# EAGLE design Thermo (EAGLE 9.6.2)
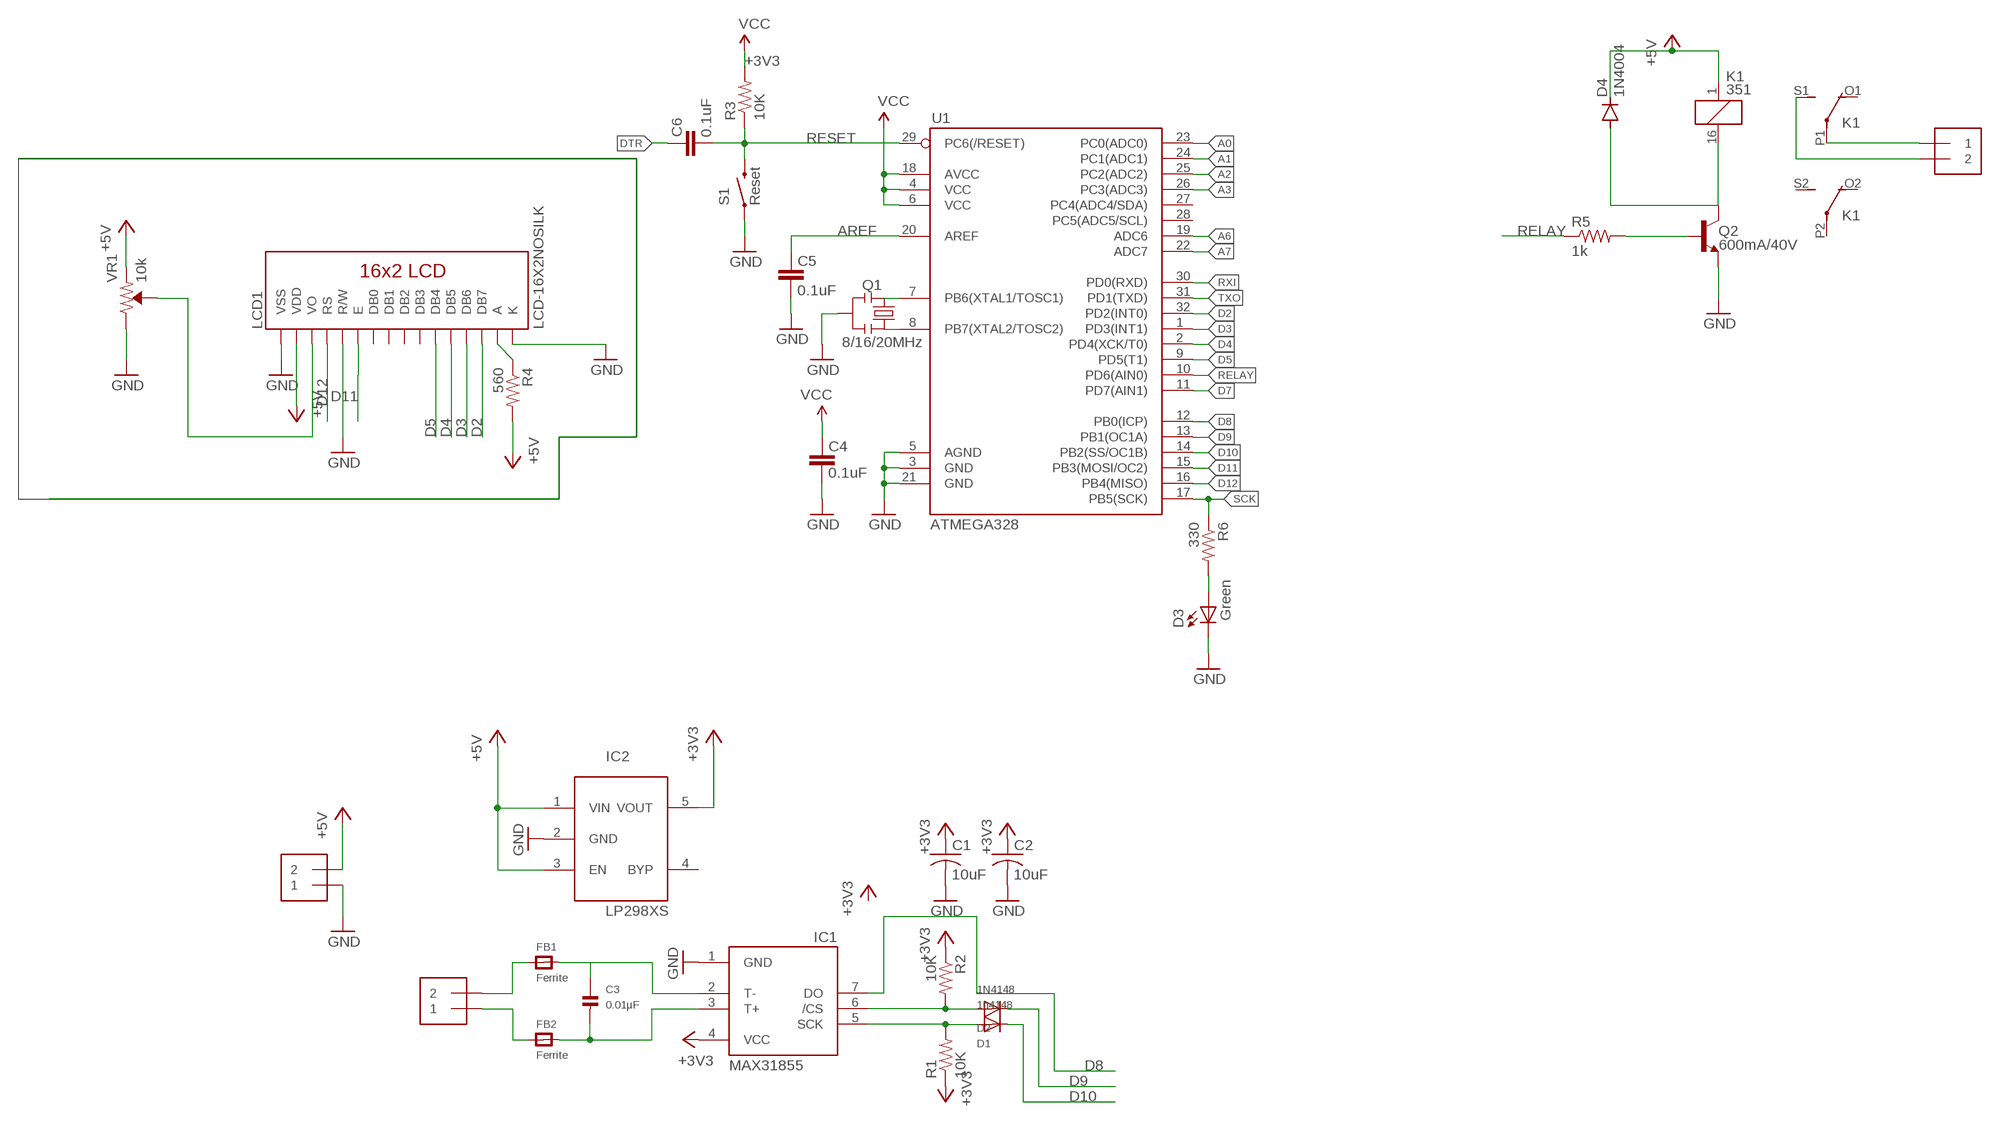
[diagram p0: schematic, sheet 1]

## Parts
C1  10uF  C-USC0805K  [C0805K]
C2  10uF  C-USC0805K  [C0805K]
C3  0.01µF  CAP_CERAMIC_0805  [_0805]
C4  0.1uF  CAP0603-CAP  [0603-CAP]
C5  0.1uF  CAP0603-CAP  [0603-CAP]
C6  0.1uF  CAP0603-CAP  [0603-CAP]
D1  1n4148  DIODESOD-323F  [SOD-323F]
D2  1N4148  DIODESOD-323F  [SOD-323F]
D3  Green  LED  [0603-LED-ALT1]
D4  1N4004  [DO41-10]
FB1  Ferrite  FERRITE_0805  [_0805]
FB2  Ferrite  FERRITE_0805  [_0805]
IC1  MAX31855  MAX6675  [SO08]
IC2  LP298XS  [SOT23-5L]
J1  1X2-3.5MM  [1X2-3.5MM]
J2  1X2-3.5MM  [1X2-3.5MM]
J3  1X2-3.5MM  [1X2-3.5MM]
K1  351  [351]
LCD1  LCD-16X2NOSILK  [LCD-16X2_NOSILK]
Q1  8/16/20MHz  RESONATOR1:1  [RESONATOR-SMD-1:1]
Q2  600mA/40V  TRANS_NPN-MMBT2222AL  [SOT23-3]
R1  10K  R-US_R0805  [R0805]
R2  10K  R-US_R0805  [R0805]
R3  10K  RESISTOR0805-RES  [0805]
R4  560  RESISTOR0805-RES  [0805]
R5  1k  RESISTOR0805-RES  [0805]
R6  330  RESISTOR0805-RES  [0805]
S1  Reset  SWITCH-MOMENTARY-2SMD-ALT01  [TACTILE-SWITCH-SMD-ALT01]
U1  ATMEGA328  ATMEGA168  [TQFP32-08]
VR1  10k  TRIMPOT-SMD-3MM-CLOSED-1/8W-20%  [TRIMPOT-SMD-3MM-CLOSED]

## Nets
+3V3: C1.1 C2.1 IC1.4(VCC) IC2.5(VOUT) R1.1 R2.1 R3.2 ; supply symbol labelled VCC
+5V: D4.C IC2.1(VIN) IC2.3(EN) J2.2 K1.1 LCD1.2(VDD) R4.2 VR1.1(CCW)
A0: U1.23(PC0(ADC0))
A1: U1.24(PC1(ADC1))
A2: U1.25(PC2(ADC2))
A3: U1.26(PC3(ADC3))
A6: U1.19(ADC6)
A7: U1.22(ADC7)
AREF: C5.2 U1.20(AREF)
CS: D2.A IC1.6(/CS) R2.2
D2: LCD1.14(DB7) U1.32(PD2(INT0))
D3: LCD1.13(DB6) U1.1(PD3(INT1))
D4: LCD1.12(DB5) U1.2(PD4(XCK/T0))
D5: LCD1.11(DB4) U1.9(PD5(T1))
D7: U1.11(PD7(AIN1))
D8: IC1.7(DO) U1.12(PB0(ICP))
D9: D2.C U1.13(PB1(OC1A))
D10: D1.C U1.14(PB2(SS/OC1B))
D11: LCD1.6(E) U1.15(PB3(MOSI/OC2))
D12: LCD1.4(RS) U1.16(PB4(MISO))
DTR: C6.2
GND: C1.2 C2.2 C4.1 C5.1 D3.C IC1.1(GND) IC2.2(GND) J2.1 LCD1.1(VSS) LCD1.5(R/W) LCD1.16(K) Q1.2 Q2.2(E) S1.1 S1.2 U1.3(GND) U1.5(AGND) U1.21(GND) VR1.3(CW)
N$1: FB1.1 J1.2
N$2: LCD1.15(A) R4.1
N$3: LCD1.3(VO) VR1.2(WIPER)
N$4: C3.1 FB1.2 IC1.2(T-)
N$5: FB2.1 J1.1
N$6: C3.2 FB2.2 IC1.3(T+)
N$7: D3.A R6.2
N$8: Q1.3 U1.8(PB7(XTAL2/TOSC2))
N$9: Q1.1 U1.7(PB6(XTAL1/TOSC1))
N$10: Q2.1(B) R5.2
N$11: D4.A K1.16 Q2.3(C)
N$12: J3.1 K1.P1(2:P)
N$13: J3.2 K1.S1(2:S)
RELAY: R5.1 U1.10(PD6(AIN0))
RESET: C6.1 R3.1 S1.3 S1.4 U1.29(PC6(/RESET))
RXI: U1.30(PD0(RXD))
SCK: D1.A IC1.5(SCK) R1.2 R6.1 U1.17(PB5(SCK))
TXO: U1.31(PD1(TXD))
VCC: C4.2 U1.4(VCC) U1.6(VCC) U1.18(AVCC)
Unconnected: IC2.4(BYP) K1.O1(2:O) K1.O2(3:O) K1.P2(3:P) K1.S2(3:S) LCD1.7(DB0) LCD1.8(DB1) LCD1.9(DB2) LCD1.10(DB3) U1.27(PC4(ADC4/SDA)) U1.28(PC5(ADC5/SCL))

## Library data of the parts
C1 C2 = adafruit:C-US: CAPACITOR, American symbol
C3 = microbuilder:CAP_CERAMIC: Ceramic Capacitors 0402 - 0402 Surface Mount Capacitors 16pF 50V 5% [Digikey: 445-4899-2-ND] 18pF 50V 5% [Digikey: 490-1281-2-ND] 22pF 50V 5% [Digikey: 490-1283-2-ND] 68pF 50V 5% [Digikey: 490-1289-2-ND] 0.1uF 10V 10% [Digikey: 490-1318-2-ND] 1.0uF 6.3V 10% [Digikey: 490-1320-2-ND] 0603 - 0603 Surface Mount Capacitors 16 pF 50V 5% [Digikey: 445-5051-2-ND] 22 pF 50V [Digikey: PCC220ACVTR-ND] 33 pF 50V 5% [Digikey: 490-1415-1-ND] 56pF 50V 5% [Digikey: 490-1421-1-ND] 220pF 50V 5% [Digikey: 445-1285-1-ND] 680 pF 50V 2200 pF 50V 5% C0G [Digikey: 445-1297-1-ND] 5600 pF 100V 5% X7R [Digikey: 478-3711-1-ND] 0.1 µF 25V 10% [Digikey: PCC2277TR-ND] 0.22 µF 16V 10% X7R [Digikey: 445-1318-1-ND] 1.0 µF 25V 10% [Digikey: 445-5146-2-ND] 0603 - RF Specific 3pF 250V +/-0.1pF RF [Digikey: 712-1347-1-ND] 18 pF 250V 5% [Digikey: 478-3505-1-ND or 712-1322-1-ND] 56 pF 250V 5% C0G RF [Digikey: 490-4867-1-ND] 68 pF 250V RF [Digikey: 490-4868-1-ND] 0805 - 0805 Surface Mount Capacitors 220 pF 250V 2% RF Ceramic Capacitor [Digikey: 712-1398-1-ND] 1000 pF 50V 2% NP0 Ceramic Capacitor [Digikey: 478-3760-1-ND] 0.1 µF 25V 10% Ceramic Capacitor [Digikey: PCC1828TR-ND] 1.0 µF 16V 10% Ceramic Capacitor[Digikey: 490-1691-2-ND] 10.0 µF 10V 10% Ceramic Capacitor[Digikey: 709-1228-1-ND] 10.0 uF 16V 10% Ceramic Capacitor [Digikey: 478-5165-2-ND] 47 uF 6.3V 20% Ceramic Capacitor [Digikey: 587-1779-1-ND or 399-5506-1-ND] 1206 - 1206 Surface Mount Capacitors 47uF 10V 20% Ceramic Capacitor [Digikey: 490-5528-1-ND or 399-5508-1-ND or 445-6010-1-ND] 100uF 6.3V -20%, +80% Y5V Ceramic Capacitor (Digikey: 490-4512-1-ND, Mouser: 81-GRM31CF50J107ZE1L)
C4-C6 = SparkFun:CAP: Capacitor Standard 0603 ceramic capacitor, and 0.1" leaded capacitor.
D1 D2 = adafruit:DIODE: Diode SMADIODE - SMA Surface Mount Package 20V 1A Schottky Diode Digikey: 641-1014-6-ND DO-1N4148 - Through Hole Small Current Diode SOD-123 20V 1 A (.5mV Vf) Schottky Diode - Digikey: MBRX120TPMSCT-ND SOD-323 10V 570mA (.38mV Vf, 3ns) Schottky Diode - Digikey: ZLLS410CT-ND SOD-523 30V 30mA Schottky Diode (RB751S-40TE61) - Digikey: RB751S-40TE61CT-ND SOT23-R/W - SOT23 Package (R = Solder Paste/Reflow Ovens, W = Hand-Soldering) BAT54Film 40V 300mA - Digikey: 497-7162-1-ND
D3 = Testing:LED: LEDs Standard schematic elements and footprints for 5mm, 3mm, 1206, and 0603 sized LEDs. 5mm - Spark Fun Electronics SKU : COM-00529 (and others)
D4 = diode:1N4004: DIODE general purpose rectifier, 1 A
FB1 FB2 = microbuilder:FERRITE: Ferrite Bead 0603 MMZ1608B121C - 120 Ohm @ 100MHz, 600mA, 0.15 Ohm DC Resistance - Digikey: 445-2164-1-ND BK1608HW121-T - 120 Ohm, 600mA Ferrite Chip - Digikey: 587-1876-2-ND 0805 HZ0805B272R-10 - 2.7K Ohm @ 100MHz, 200mA, 0.8 Ohm DC Resistance - Digikey: 240-2504-1-ND (see also Murata BLM21BD272SN1L) MMZ2012Y152B - 1.5K Ohm @ 100MHz, 500mA, 0.4 Ohm DC Resistance - Digikey: 445-1560-1-ND - Mainly for high frequency (80-400MHz) MMZ2012R102A - 1K Ohm @ 100MHz, 500mA, 0.3 Ohm DC Resistance - Digikey: 445-1555-2-ND - More general purpose (10-200MHz)
IC1 = adafruit:MAX6675
IC2 = adafruit:LP298X
J1-J3 = adafruit:1X2: 3.5mm Terminal block http://www.ladyada.net/library/pcb/eaglelibrary.html
K1 = relay:351: RELAY 2 x switch, Omron; OC_FARNELL: unknown; OC_NEWARK: unknown
LCD1 = SparkFun-Displays:LCD-16X2: Standard text-only 16x2 parallel input LCD Basic 16 character by 2 line display. Typically utilizes the extremely common HD44780 parallel interface chipset SparkFun Products: Basic 16x2 Green <https://www.sparkfun.com/products/255> Basic 8x2 Green <https://www.sparkfun.com/products/11122>; SF_ID: LCD-00255
Q1 = Testing:RESONATOR: Resonator Small SMD resonator. This is the itty bitty 10/20MHz resonators with built in caps. CSTCE10M0G55 and CSTCE20M0V53. Footprint for SMD has been used in SFE production for years, and does work okay. 1:1 is an attempt to get larger fillets on the sides so it will be easier to inspect these solders in our AOI machine. The pads have been minimized to match the actual metal under the resonator. To see this relation, it includes an image import of the bottom side of the component. Imported to scale on layer 200.
Q2 = SparkFun-DiscreteSemi:TRANS_NPN: NPN transistor Current controlled devices typically used to amplify current or used as a switch. BC547 - COM-08928 <http://www.sparkfun.com/products/8928> (TO-92 45V 100mA) (1.Collector 2.Base 3.Emitter) 2N3904 - COM-00521 <http://www.sparkfun.com/products/521> (TO-92 40V 200mA) (1.Emitter 2.Base 3.Collector) P2N2222A - COM-12852 <http://www.sparkfun.com/products/12852> (TO-92 40V 600mA) (1.Collector 2.Base 3.Emitter); PROD_ID: TRANS-08049
R1 R2 = adafruit:R-US_: RESISTOR, American symbol
R3-R6 = SparkFun:RESISTOR: Resistor Basic schematic elements and footprints for 0603, 1206, and PTH resistors.
S1 = Testing:SWITCH-MOMENTARY-2: Various NO switches- pushbuttons, reed, etc
U1 = SparkFun:ATMEGA168
VR1 = SparkFun-Resistors:TRIMPOT: Trimming Potentiometer (Trimpot) Three-terminal potentiometers, with an adjustable wiper and two adjustable resistors. A pot can be used to create a configurable voltage divider, or as a variable resistor. "Trimpots" are a subset of potentiometers, usually intended for "set-and-forget" applications. They're often more delicate than standard potentiometers - rated for fewer turns. Variants PTH-KNOB - PTH Trimpot w/ finger-adjustable knob Trimpot 10K with Knob <https://www.sparkfun.com/products/9806> (COM-09806) Datasheet <http://www.sparkfun.com/datasheets/Components/General/TSR-3386.pdf> SMD-3MM-CLOSED-FRAME - SMD 3mm Square Closed-Frame Trimpot Used on e.g. EasyDriver - Stepper Motor Driver <https://www.sparkfun.com/products/12779> Datasheet <http://www.bitechnologies.com/pdfs/22.pdf> (22AR10KTR) SMD-5MM - SMD 5mm Square Closed-Frame Trimpot Used on e.g. IOIO-OTG - V2.2 <https://www.sparkfun.com/products/13613> Datasheet <http://www.vishay.com/docs/51008/ts53.pdf> (TS53YL502MR10) SMD-3MM-1/10W-25% - 3mm Square Open-Frame Trimpot Used on e.g. SparkFun Shapeoko <https://www.sparkfun.com/products/13899> Datasheet <http://www.bourns.com/docs/Product-Datasheets/TC33.pdf> (TC33X-2-103E); PROD_ID: RES-09285

## Net classes
1 vcc: width 0.254 mm

## Board
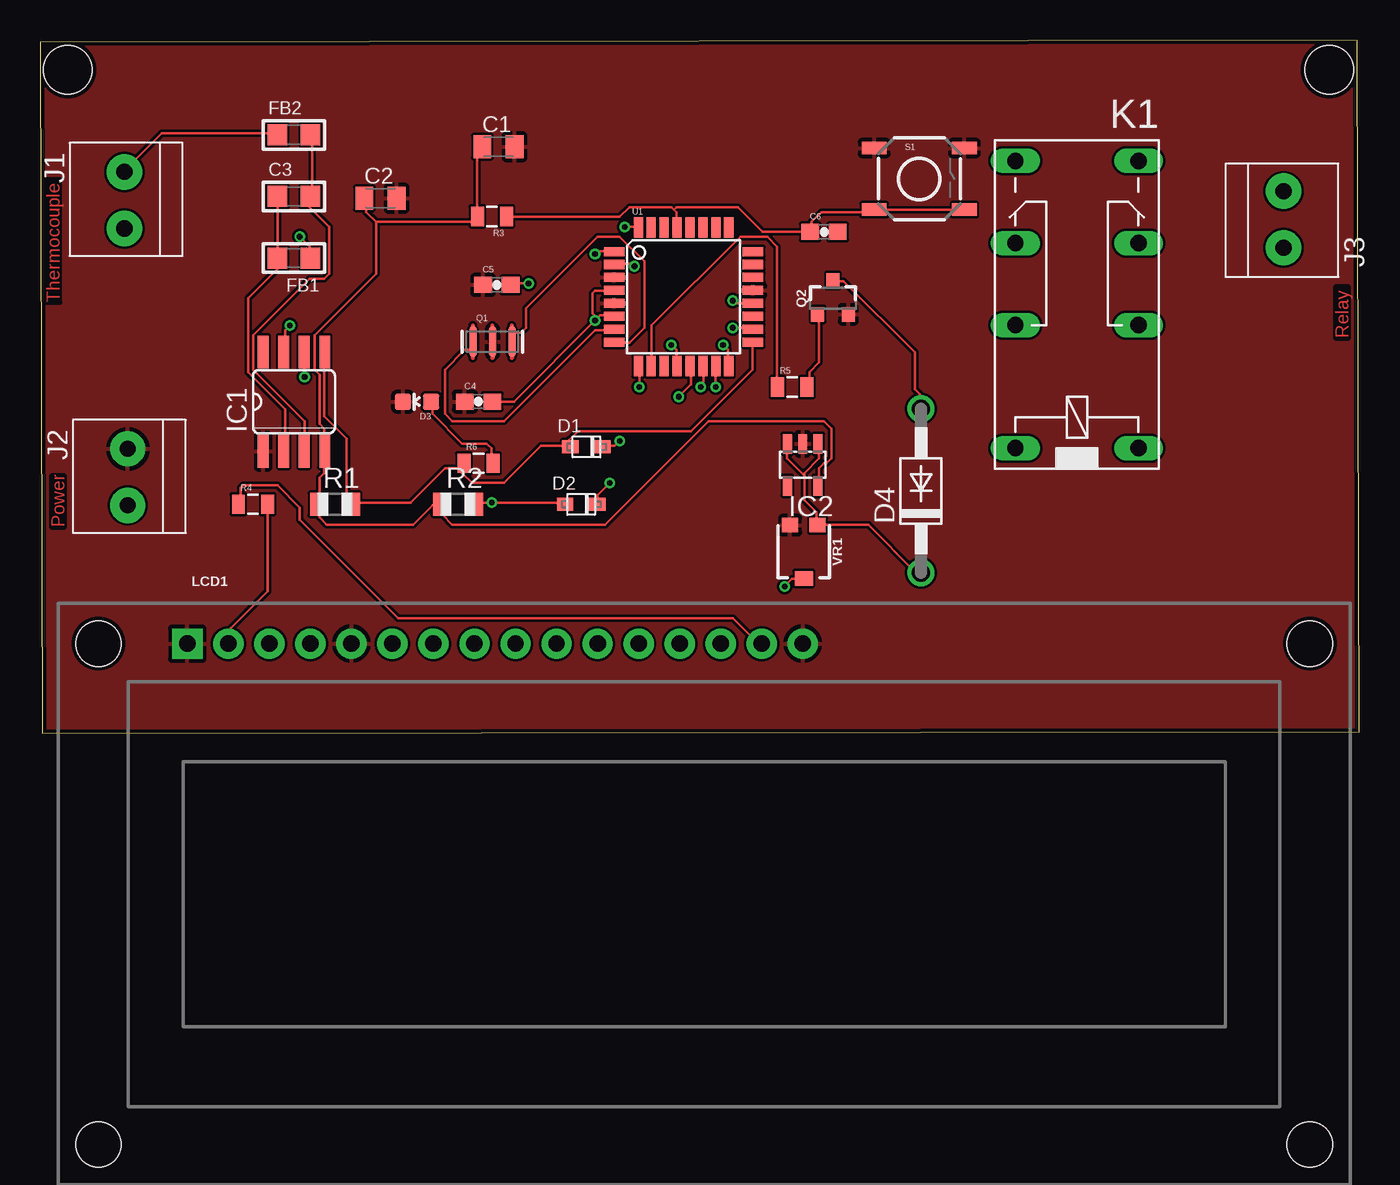
[diagram p1: board, top side]
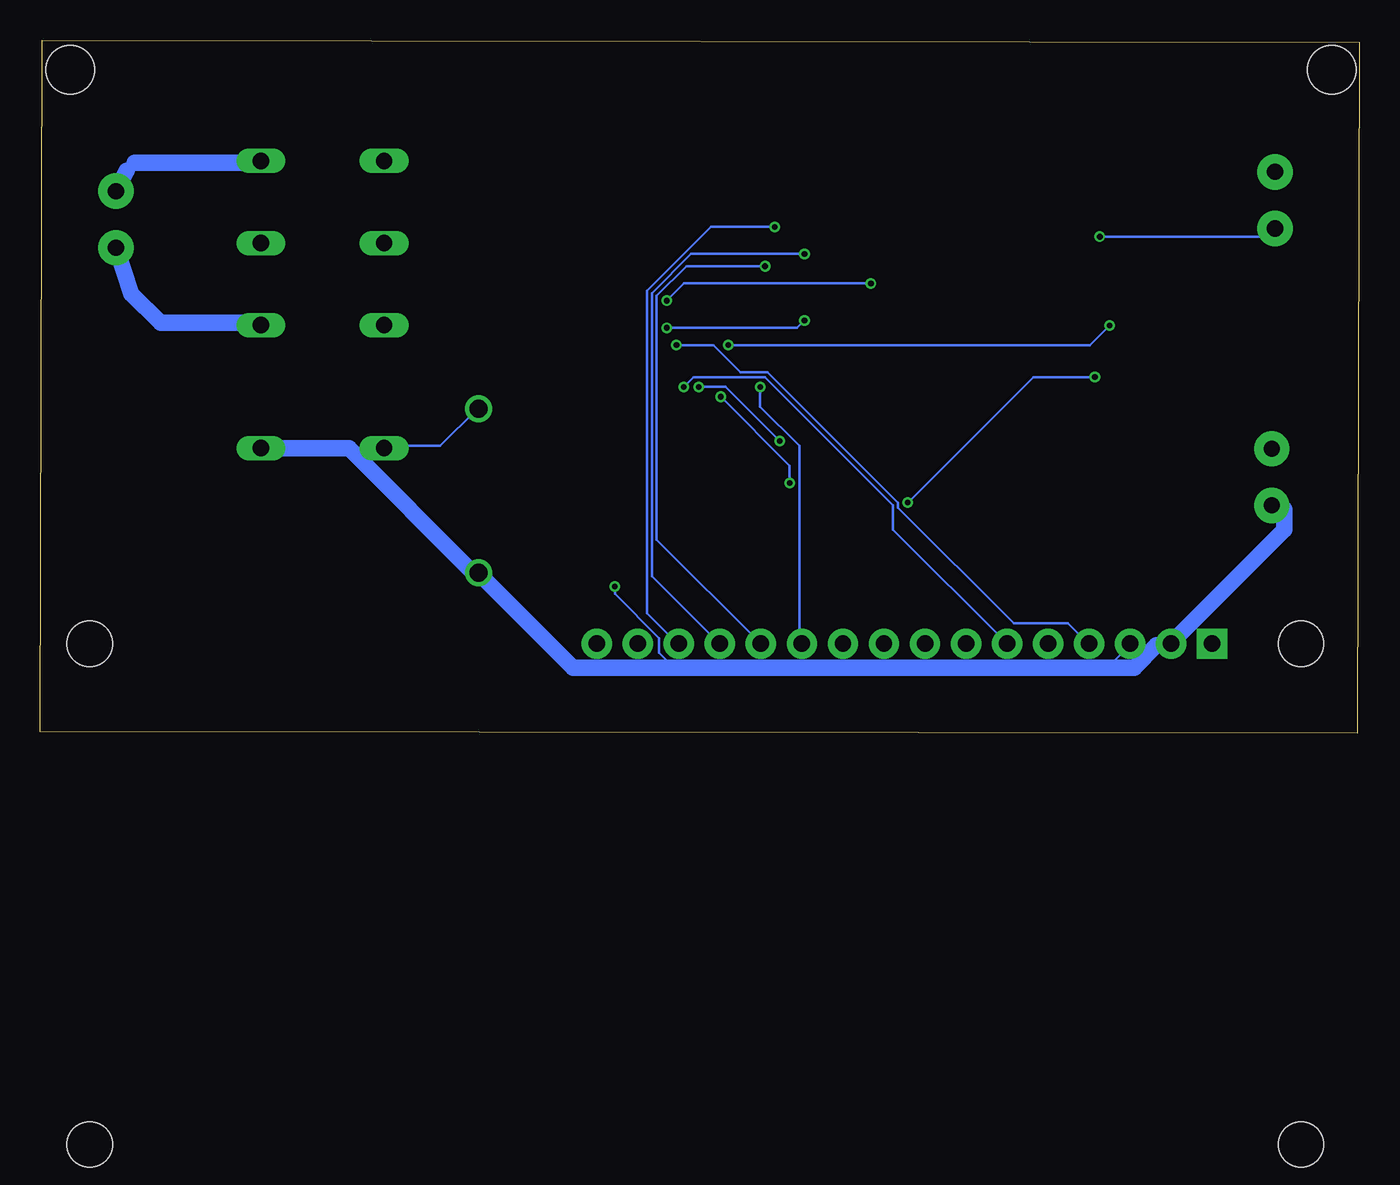
[diagram p2: board, bottom side, seen from below]

Size 81.65 x 42.88 mm. Coordinates in mm from the lower left corner, seen from the top.
Outline: 0.1,0 81.65,0.1 81.55,42.88 0,42.78 0.1,0
Copper layers (1*16): Top 0.035mm / dielectric 1.5mm / Bottom 0.035mm
Design rules "SeeedStudio_2layer_DRU_no_angle_20140221": minimum track width 6mil, minimum drill 12mil, track to track 6mil, track to pad 6mil, pad to pad 6mil, via to via 6mil, smd to smd 0mil, copper to edge 10mil, drill to drill 10mil, minimum pad ring 10mil, minimum via ring 6mil, stop-mask expansion 2mil, vias tented up to drill 100mil, thermal gap 10mil
Holes 3 mm at 1.7,41.06 79.8,41.06

### Footprints (pad centres in the part's own frame; a part is rotated, then mirrored left to right if it is on the bottom)
C0805K = smd 1.1 x 1.4: 1 -1,0; 2 1,0
_0805 = smd 1.2 x 1.3: 1 -1.016,0; 2 1.016,0
0603-CAP = smd 1.1 x 1: 1 -0.85,0; 2 0.85,0
SOD-323F = smd 1 x 0.8: A -1,0; C 1,0
0603-LED-ALT1 = smd 1 x 1: A 0,-0.877; C 0,0.877
DO41-10 = drill 1.118: A 5.08,0; C -5.08,0
SO08 = smd 0.66 x 2.032: 1 -1.905,-3.073; 2 -0.635,-3.073; 3 0.635,-3.073; 4 1.905,-3.073; 5 1.905,3.073; 6 0.635,3.073; 7 -0.635,3.073; 8 -1.905,3.073
SOT23-5L = smd 0.55 x 1.2: 1 -0.95,-1.3; 2 0,-1.3; 3 0.95,-1.3; 4 0.95,1.3; 5 -0.95,1.3
1X2-3.5MM = drill 1 pad 2.184: 1 1.8,0; 2 -1.7,0
351 = drill 1.016 long: 1 -3.81,-3.81; 16 -3.81,3.81; O1 8.89,-3.81; O2 8.89,3.81; P1 3.81,-3.81; P2 3.81,3.81; S1 13.97,-3.81; S2 13.97,3.81
LCD-16X2_NOSILK = drill 1.016 pad 1.88 square: 1 -32,15.5 | drill 1.016 pad 1.88: 2 -29.46,15.5; 3 -26.92,15.5; 4 -24.38,15.5; 5 -21.84,15.5; 6 -19.3,15.5; 7 -16.76,15.5; 8 -14.22,15.5; 9 -11.68,15.5; 10 -9.14,15.5; 11 -6.6,15.5; 12 -4.06,15.5; 13 -1.52,15.5; 14 1.02,15.5; 15 3.56,15.5; 16 6.1,15.5 | hole 2.8: -37.5,15.5; -37.5,-15.5; 37.5,15.5; 37.5,-15.5
RESONATOR-SMD-1:1 = smd 0.45 x 1.905: 1 -1.2,0; 2 0,0; 3 1.2,0
SOT23-3 = smd 0.8 x 0.9: 1 -0.95,-1; 2 0.95,-1; 3 0,1.1
R0805 = smd 1.1 x 1.4: 1 -1,0; 2 1,0
0805 = smd 0.8 x 1.2: 1 -0.9,0; 2 0.9,0
TACTILE-SWITCH-SMD-ALT01 = smd 1.524 x 0.762: 1 -2.794,1.905; 2 2.794,1.905; 3 -2.794,-1.905; 4 2.794,-1.905
TQFP32-08 = smd 1.27 x 0.559: 1 -4.293,2.8; 2 -4.293,2; 3 -4.293,1.2; 4 -4.293,0.4; 5 -4.293,-0.4; 6 -4.293,-1.2; 7 -4.293,-2; 8 -4.293,-2.8; 17 4.293,-2.8; 18 4.293,-2; 19 4.293,-1.2; 20 4.293,-0.4; 21 4.293,0.4; 22 4.293,1.2; 23 4.293,2; 24 4.293,2.8 | smd 0.559 x 1.27: 9 -2.8,-4.293; 10 -2,-4.293; 11 -1.2,-4.293; 12 -0.4,-4.293; 13 0.4,-4.293; 14 1.2,-4.293; 15 2,-4.293; 16 2.8,-4.293; 25 2.8,4.293; 26 2,4.293; 27 1.2,4.293; 28 0.4,4.293; 29 -0.4,4.293; 30 -1.2,4.293; 31 -2,4.293; 32 -2.8,4.293
TRIMPOT-SMD-3MM-CLOSED = smd 1 x 0.9: 1 -0.85,-1.65; 3 0.85,-1.65 | smd 1.1 x 0.9: 2 0,1.65

### Placement (x,y rotation side)
C1  28.36,36.3 0 top
C2  21.06,33.11 0 top
C3  15.7,33.22 0 top
C4  27.13,20.52 0 top
C5  28.26,27.75 0 top
C6  48.52,31.03 0 top
D1  33.81,17.72 0 top
D2  33.48,14.17 0 top
D3  23.32,20.52 90 top
D4  54.53,15 90 top
FB1  15.7,29.41 180 top
FB2  15.7,37.03 0 top
IC1  15.7,20.52 0 top
IC2  47.2,16.61 180 top
J1  5.21,32.94 90 top
J2  5.41,15.8 90 top
J3  76.97,31.85 270 top
K1  64.18,21.45 90 top
LCD1  41.1,-9.96 0 top
Q1  27.99,24.23 0 top
Q2  49.07,26.92 0 top
R1  18.24,14.17 0 top
R2  25.86,14.17 0 top
R3  27.96,31.99 180 top
R4  13.16,14.17 0 top
R5  46.55,21.42 0 top
R6  27.13,16.71 0 top
S1  54.42,34.31 0 top
U1  39.82,27.01 0 top
VR1  47.27,11.23 180 top

### Tracks (layer width: path | path; a pad name or v marks a point on that pad's centre or on a via)
+3V3
  Top 0.152: C1.1 27.33,36.22 27.03,35.91 27.03,32.1 R3.2 27.03,31.95 26.72,31.64 20.78,31.64 | 20.78,31.64 20.17,32.25 20.17,33.02 C2.1 | IC2.5 48.21,15.34 48.21,16.41 48.52,16.71 48.67,16.71 48.97,17.02 48.97,18.84 48.52,19.3 41.35,19.3 34.95,12.9 25.5,12.9 24.89,13.51 24.89,14.12 R2.1 24.74,14.12 24.29,14.12 23.07,12.9 17.73,12.9 17.28,13.36 17.28,14.12 R1.1 17.28,14.27 17.28,15.8 17.58,16.1 17.58,17.32 IC1.4 17.58,17.47 17.58,18.84 17.28,19.15 17.28,22.2 16.97,22.5 16.97,24.64 20.78,28.45 20.78,31.64
+5V
  Top 0.152: R4.2 14.07,14.12 14.07,8.79 11.79,6.5 11.79,5.58 LCD1.2 | 47.3,15.95 47.3,16.1 48.21,17.02 48.21,17.78 IC2.1 | 47.3,15.95 47.3,14.42 48.06,13.66 48.06,12.9 VR1.1 48.21,12.9 51.26,12.9 54.16,10 54.46,10 D4.C | 47.3,15.95 46.23,17.02 46.23,17.78 IC2.3
  Bottom 0.152: 4.63,13.88 J2.2 | 11.64,5.58 LCD1.2 11.79,5.43 12.55,5.43 | 54.92,10 54.61,10 D4.C 54.46,9.85 | 67.87,17.62 K1.1
  Bottom 1.016: 4.63,13.88 4.63,12.6 11.64,5.58 | 67.87,17.62 62.54,17.62 54.92,10 | 12.55,5.43 13.92,4.06 48.67,4.06 54.46,9.85
AREF  (via drill 0.35)
  Top 0.152: v30.23,27.84 29.16,27.84 C5.2 | v42.88,26.77 43.03,26.62 44.1,26.62 U1.20
  Bottom 0.152: v30.23,27.84 41.81,27.84 v42.88,26.77
CS  (via drill 0.35)
  Top 0.152: D2.A 32.36,14.27 v27.94,14.27 26.88,14.27 R2.2 | v16.36,22.04 16.36,23.57 IC1.6
  Bottom 0.152: v16.36,22.04 20.17,22.04 v27.94,14.27
D2  (via drill 0.35)
  Top 0.152: v36.17,31.34 36.93,31.34 U1.32
  Bottom 0.152: v36.17,31.34 40.14,31.34 44.1,27.38 44.1,7.41 42.27,5.58 LCD1.14
D3  (via drill 0.35)
  Top 0.152: v34.34,29.66 34.5,29.82 35.41,29.82 U1.1
  Bottom 0.152: v34.34,29.66 41.35,29.66 43.79,27.23 43.79,9.7 39.68,5.58 LCD1.13
D4  (via drill 0.35)
  Top 0.152: v36.78,28.9 36.63,29.05 35.56,29.05 U1.2
  Bottom 0.152: v36.78,28.9 41.66,28.9 43.49,27.07 43.49,11.99 37.09,5.58 LCD1.12
D5  (via drill 0.35)
  Top 0.152: v37.09,21.43 37.09,22.65 U1.9
  Bottom 0.152: v37.09,21.43 37.09,20.21 34.65,17.78 34.65,5.58 LCD1.11
D8  (via drill 0.35)
  Top 0.152: v39.07,24.02 39.37,23.72 39.37,22.81 U1.12 | v15.45,25.24 15.14,24.94 15.14,23.72 IC1.7
  Bottom 0.152: v39.07,24.02 16.66,24.02 v15.45,25.24
D9  (via drill 0.35)
  Top 0.152: v35.26,15.49 34.5,14.73 34.5,14.27 D2.C | v39.53,20.82 40.29,21.59 40.29,22.65 U1.13
  Bottom 0.152: v35.26,15.49 35.26,16.56 v39.53,20.82
D10  (via drill 0.35)
  Top 0.152: v35.87,18.08 35.56,17.78 34.95,17.78 D1.C | v40.9,21.43 40.9,21.59 41.05,21.74 41.05,22.65 U1.14
  Bottom 0.152: v35.87,18.08 39.22,21.43 v40.9,21.43
D11  (via drill 0.35)
  Top 0.152: v41.81,21.43 41.81,22.65 U1.15
  Bottom 0.152: v41.81,21.43 41.2,22.04 36.78,22.04 28.86,14.12 28.86,12.6 21.85,5.58 LCD1.6
D12  (via drill 0.35)
  Top 0.152: v42.27,24.02 42.57,23.72 42.57,22.81 U1.16
  Bottom 0.152: v42.27,24.02 39.98,24.02 38.31,22.35 36.63,22.35 28.55,14.27 28.55,13.97 21.39,6.8 18.04,6.8 16.82,5.58 LCD1.4
GND
  pour Top: -1.4,43.26 81.7,43.26 81.7,-0.14 -1.4,-0.14
N$1  (via drill 0.35)
  Top 0.152: v16.06,30.73 16.66,30.12 16.66,29.51 FB1.1
  Bottom 0.152: v16.06,30.73 5.44,30.73 J1.2
N$2
  Top 0.152: R4.1 12.4,14.27 12.4,15.19 12.55,15.34 14.68,15.34 16.06,13.97 16.06,13.21 22.15,7.11 42.88,7.11 44.55,5.43 LCD1.15
N$3  (via drill 0.35)
  Top 0.152: v46.08,9.09 46.54,9.55 47.14,9.55 VR1.2
  Bottom 0.152: v46.08,9.09 46.08,8.63 43.33,5.89 43.33,4.98 42.73,4.37 15.29,4.37 14.23,5.43 LCD1.3
N$4
  Top 0.152: C3.1 FB1.2 14.68,28.75 12.86,26.92 12.86,22.35 15.14,20.06 15.14,17.47 IC1.2
N$5
  Top 0.152: FB2.1 14.68,37.13 7.52,37.13 5.24,34.85 5.27,34.8 J1.1
N$6
  Top 0.152: FB2.2 16.82,36.98 16.82,33.32 C3.2 16.66,33.17 16.66,32.56 17.88,31.34 17.88,28.45 17.58,28.14 16.66,28.14 13.16,24.64 13.16,22.5 16.36,19.3 16.36,17.47 IC1.3
N$7
  Top 0.152: D3.A 24.29,20.52 24.29,19.76 26.11,17.93 27.64,17.93 27.94,17.62 27.94,16.71 R6.2
N$8
  Top 0.152: U1.8 35.56,24.18 36.48,24.18 37.39,25.09 37.39,29.21 35.87,30.73 34.5,30.73 30.08,26.31 30.08,25.09 29.77,24.79 29.31,24.79 Q1.3
N$9
  Top 0.152: U1.7 35.41,24.94 34.34,24.94 28.71,19.3 25.5,19.3 25.05,19.76 25.05,22.5 26.27,23.72 26.72,23.72 Q1.1
N$10
  Top 0.152: Q2.1 48.21,25.85 48.21,22.96 47.6,22.35 47.6,21.59 47.45,21.43 R5.2
N$11
  Top 0.152: Q2.3 49.13,27.99 49.74,27.99 54.16,23.57 54.16,21.28 54.46,20.98 54.46,20.21 D4.A
  Bottom 0.152: K1.16 60.25,17.78 56.9,17.78 54.61,20.06 D4.A
N$12
  Bottom 0.152: 68.02,25.4 K1.P1
  Bottom 1.016: 68.02,25.4 74.21,25.4 76.02,27.21 J3.1
N$13
  Bottom 0.152: 76.3,34.8 75.8,35.3 | 68.02,35.3 K1.S1
  Bottom 1.016: 75.8,35.3 68.02,35.3 | 76.3,34.8 J3.2
RELAY
  Top 0.152: R5.1 45.62,21.43 45.62,30.12 45.01,30.73 43.33,30.73 37.85,25.24 37.85,22.81 U1.10
RESET
  Top 0.152: S1.4 51.72,32.41 S1.3 51.56,32.25 48.36,32.25 47.75,31.64 47.75,31.04 C6.1 47.6,31.04 44.71,31.04 43.18,32.56 39.37,32.56 39.22,32.41 | 39.22,32.41 39.37,32.25 39.37,31.34 U1.29 | 39.22,32.41 39.07,32.56 36.48,32.56 35.87,31.95 29.01,31.95 R3.1
SCK
  Top 0.152: 32.36,17.78 30.99,17.78 28.71,15.49 26.72,15.49 26.11,16.1 26.11,16.41 | 32.36,17.78 32.67,17.78 D1.A 32.36,17.78 | 26.11,16.41 26.11,16.71 R6.1 26.11,16.41 | 32.36,17.78 33.28,18.69 40.29,18.69 44.1,22.5 44.1,24.18 U1.17 | 26.11,16.41 25.05,16.41 22.91,14.27 19.26,14.27 R1.2 19.1,14.27 18.95,14.42 18.95,18.23 17.58,19.61 17.58,23.57 IC1.5
VCC  (via drill 0.35)
  Top 0.152: C4.2 29.31,20.52 v34.34,25.55 34.5,25.7 | 34.5,25.7 34.65,25.85 35.41,25.85 U1.6 | 34.5,25.7 34.19,26.01 34.19,27.23 34.34,27.38 35.41,27.38 U1.4 | v42.88,25.09 44.1,25.09 U1.18
  Bottom 0.152: v42.88,25.09 34.8,25.09 v34.34,25.55

### Text on the board
Top: Thermocouple | Relay | Power